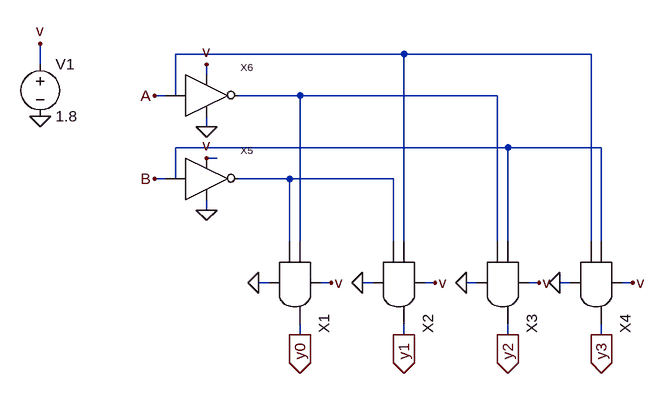
[diagram p0: schematic 2_4_decoder.asc]
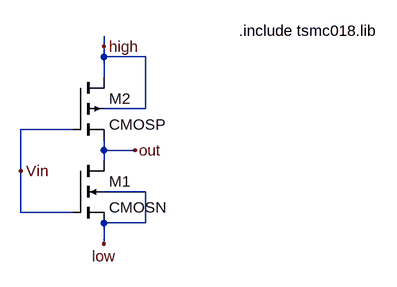
[diagram p1: sub-circuit inverter.asc]
2_4_decoder.asc, the LTspice schematic file:
Version 4
SHEET 1 880 680
WIRE 240 -112 -112 -112
WIRE 528 -112 240 -112
WIRE -320 -96 -320 -128
WIRE -64 -80 -64 -96
WIRE -128 -48 -144 -48
WIRE -112 -48 -112 -112
WIRE 80 -48 -16 -48
WIRE 384 -48 80 -48
WIRE -64 0 -64 -16
WIRE 400 32 -112 32
WIRE 544 32 400 32
WIRE -48 48 -64 48
WIRE -128 80 -144 80
WIRE -112 80 -112 32
WIRE 64 80 -16 80
WIRE 224 80 64 80
WIRE -64 128 -64 112
WIRE 64 176 64 80
WIRE 80 176 80 -48
WIRE 224 176 224 80
WIRE 240 176 240 -112
WIRE 384 176 384 -48
WIRE 400 176 400 32
WIRE 528 176 528 -112
WIRE 544 176 544 32
WIRE 32 240 16 240
WIRE 128 240 112 240
WIRE 192 240 176 240
WIRE 288 240 272 240
WIRE 352 240 336 240
WIRE 448 240 432 240
WIRE 496 240 480 240
WIRE 592 240 576 240
WIRE 80 320 80 304
WIRE 240 320 240 304
WIRE 400 320 400 304
WIRE 544 320 544 304
FLAG -144 -48 A
FLAG -144 80 B
FLAG 80 320 y0
IOPIN 80 320 Out
FLAG 240 320 y1
IOPIN 240 320 Out
FLAG 400 320 y2
IOPIN 400 320 Out
FLAG 544 320 y3
IOPIN 544 320 Out
FLAG -64 0 0
FLAG -64 128 0
FLAG 16 240 0
FLAG 176 240 0
FLAG 336 240 0
FLAG 480 240 0
FLAG -320 -16 0
FLAG -320 -128 v
FLAG 128 240 v
FLAG 288 240 v
FLAG 448 240 v
FLAG 592 240 v
FLAG -64 48 v
FLAG -64 -96 v
SYMBOL and 64 288 R90
SYMATTR InstName X1
SYMBOL and 224 288 R90
SYMATTR InstName X2
SYMBOL and 384 288 R90
SYMATTR InstName X3
SYMBOL and 528 288 R90
SYMATTR InstName X4
SYMBOL Inverter -32 96 R0
SYMATTR InstName X5
SYMBOL Inverter -32 -32 R0
SYMATTR InstName X6
SYMBOL voltage -320 -112 R0
WINDOW 123 0 0 Left 0
WINDOW 39 0 0 Left 0
SYMATTR InstName V1
SYMATTR Value 1.8

inverter.asc, the sub-circuit schematic file:
Version 4
SHEET 1 880 680
WIRE 192 -16 192 -32
WIRE 192 0 192 -16
WIRE 256 0 192 0
WIRE 192 32 192 0
WIRE 256 80 256 0
WIRE 256 80 192 80
WIRE 144 112 64 112
WIRE 192 144 192 128
WIRE 240 144 192 144
WIRE 192 160 192 144
WIRE 64 176 64 112
WIRE 256 208 192 208
WIRE 64 240 64 176
WIRE 144 240 64 240
WIRE 256 256 256 208
WIRE 256 256 192 256
WIRE 192 288 192 256
FLAG 64 176 Vin
FLAG 192 -16 high
FLAG 192 288 low
FLAG 240 144 out
SYMBOL cmosn 144 160 R0
SYMATTR InstName M1
SYMATTR Value2 l=180n w=1u
SYMBOL cmosp 144 32 R0
SYMATTR InstName M2
SYMATTR Value2 l=180n w=1200n
TEXT 400 -40 Left 2 !.include tsmc018.lib

The netlist it stands for:
* 2_4_decoder.asc
XX1 N002 N004 v 0 y0 and  ; pins a b vdd vss And
XX2 N001 N004 v 0 y1 and  ; pins a b vdd vss And
XX3 N003 N002 v 0 y2 and  ; pins a b vdd vss And
XX4 N003 N001 v 0 y3 and  ; pins a b vdd vss And
XX5 v 0 B N004 inverter
XX6 v 0 A N002 inverter
V1 v 0 1.8

* block symbol definitions
.subckt inverter high low Vin out
M1 out Vin low low CMOSN l=180n w=1u
M2 high Vin out high CMOSP l=180n w=1200n
.include tsmc018.lib
.ends inverter

.model NMOS NMOS
.model PMOS PMOS
.lib standard.mos
.backanno
.end